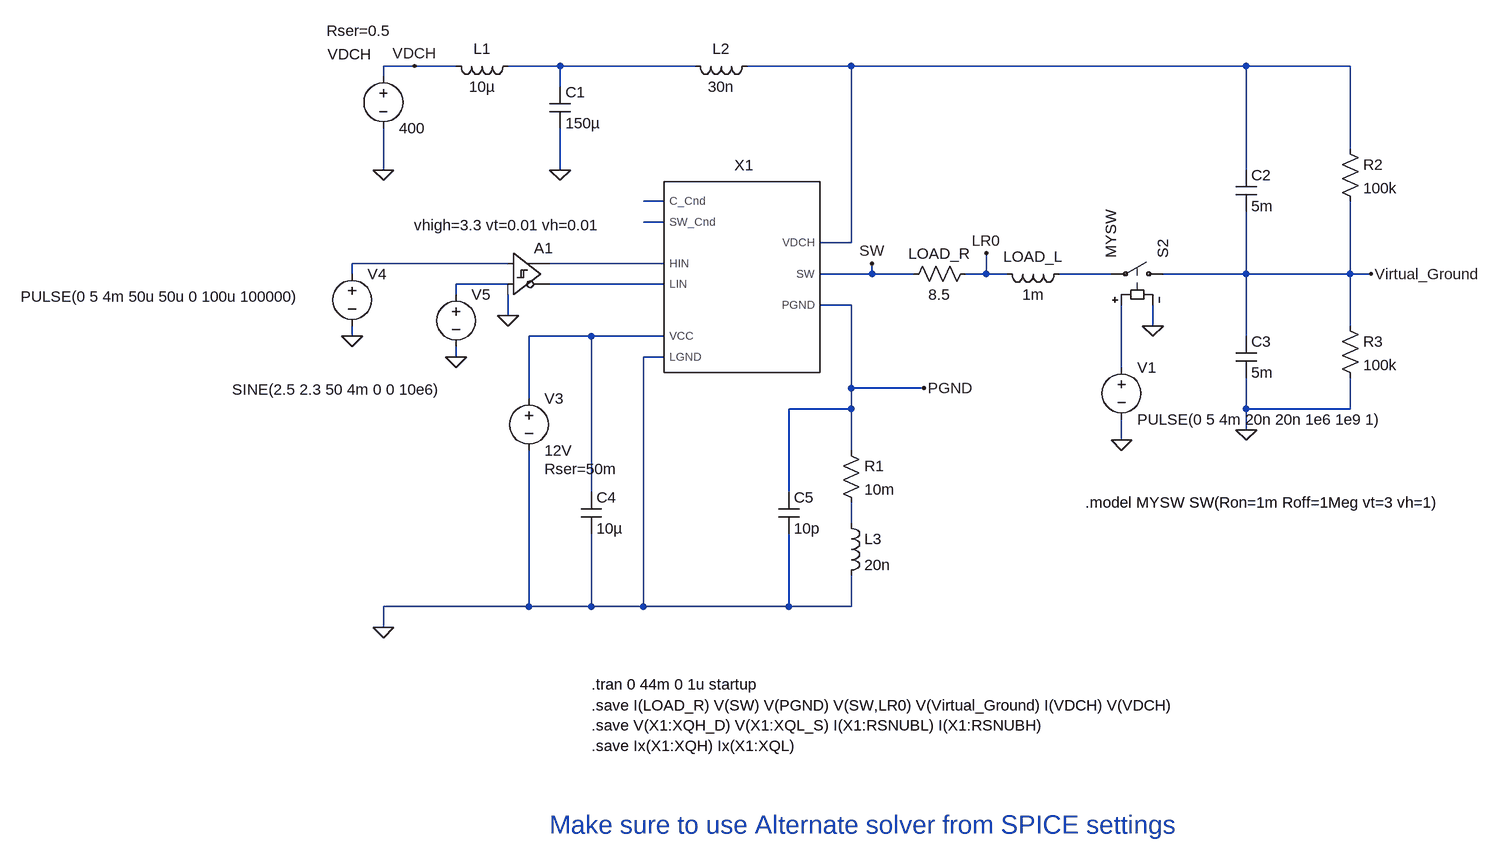
[diagram p0: schematic HBM_SLinverter_test1.asc]
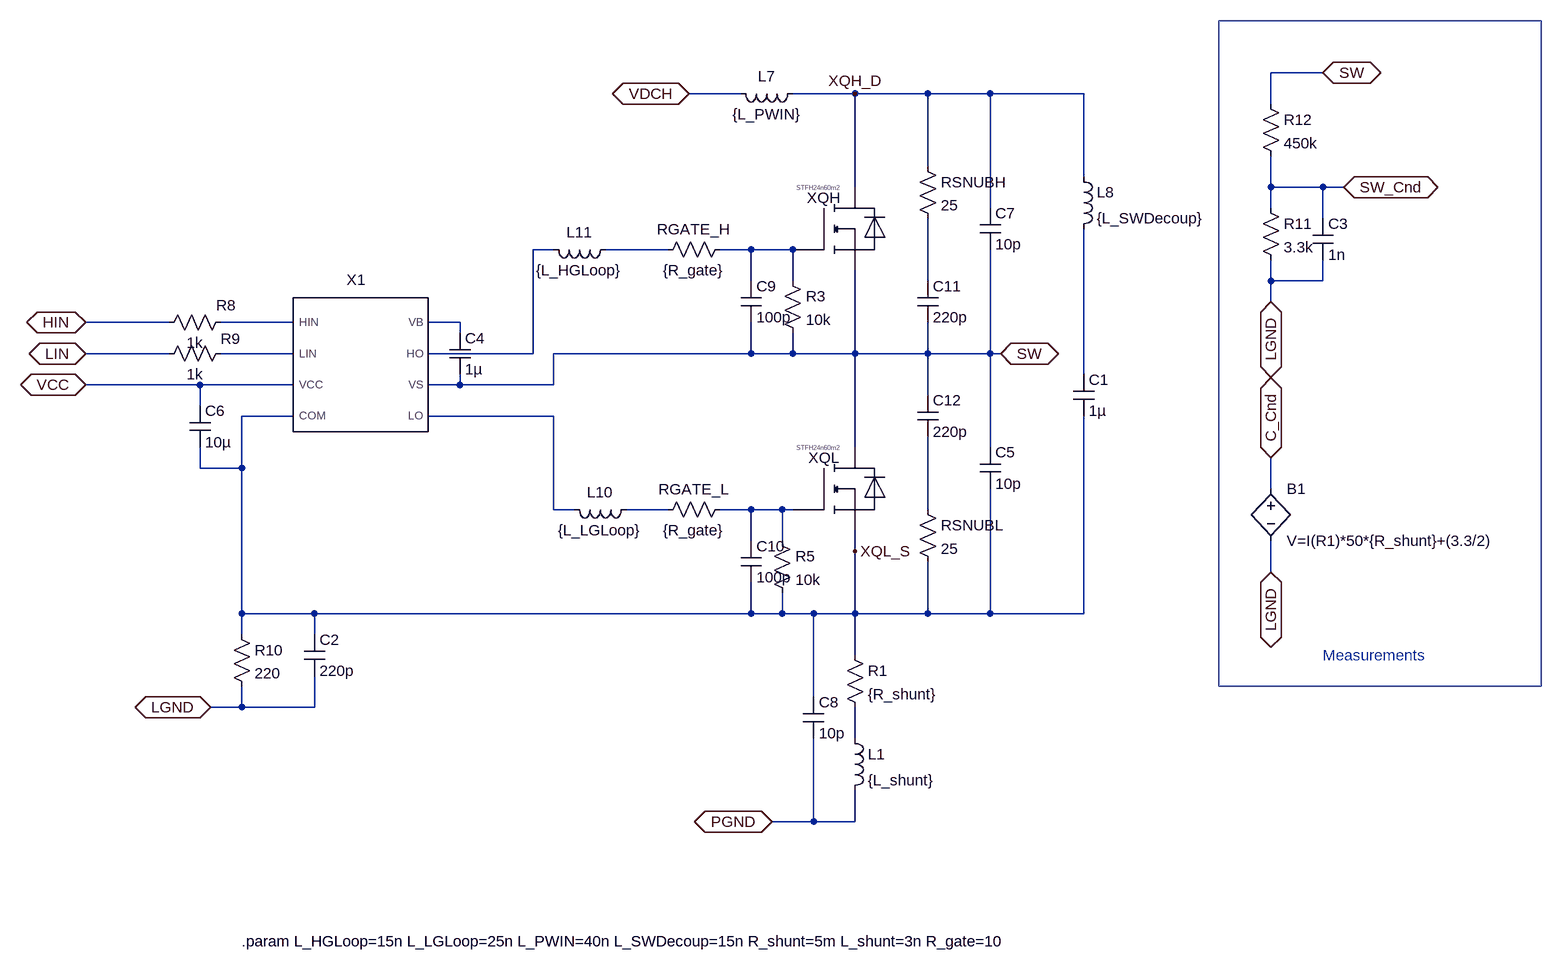
[diagram p1: sub-circuit hbm_g0vh4c5.asc]
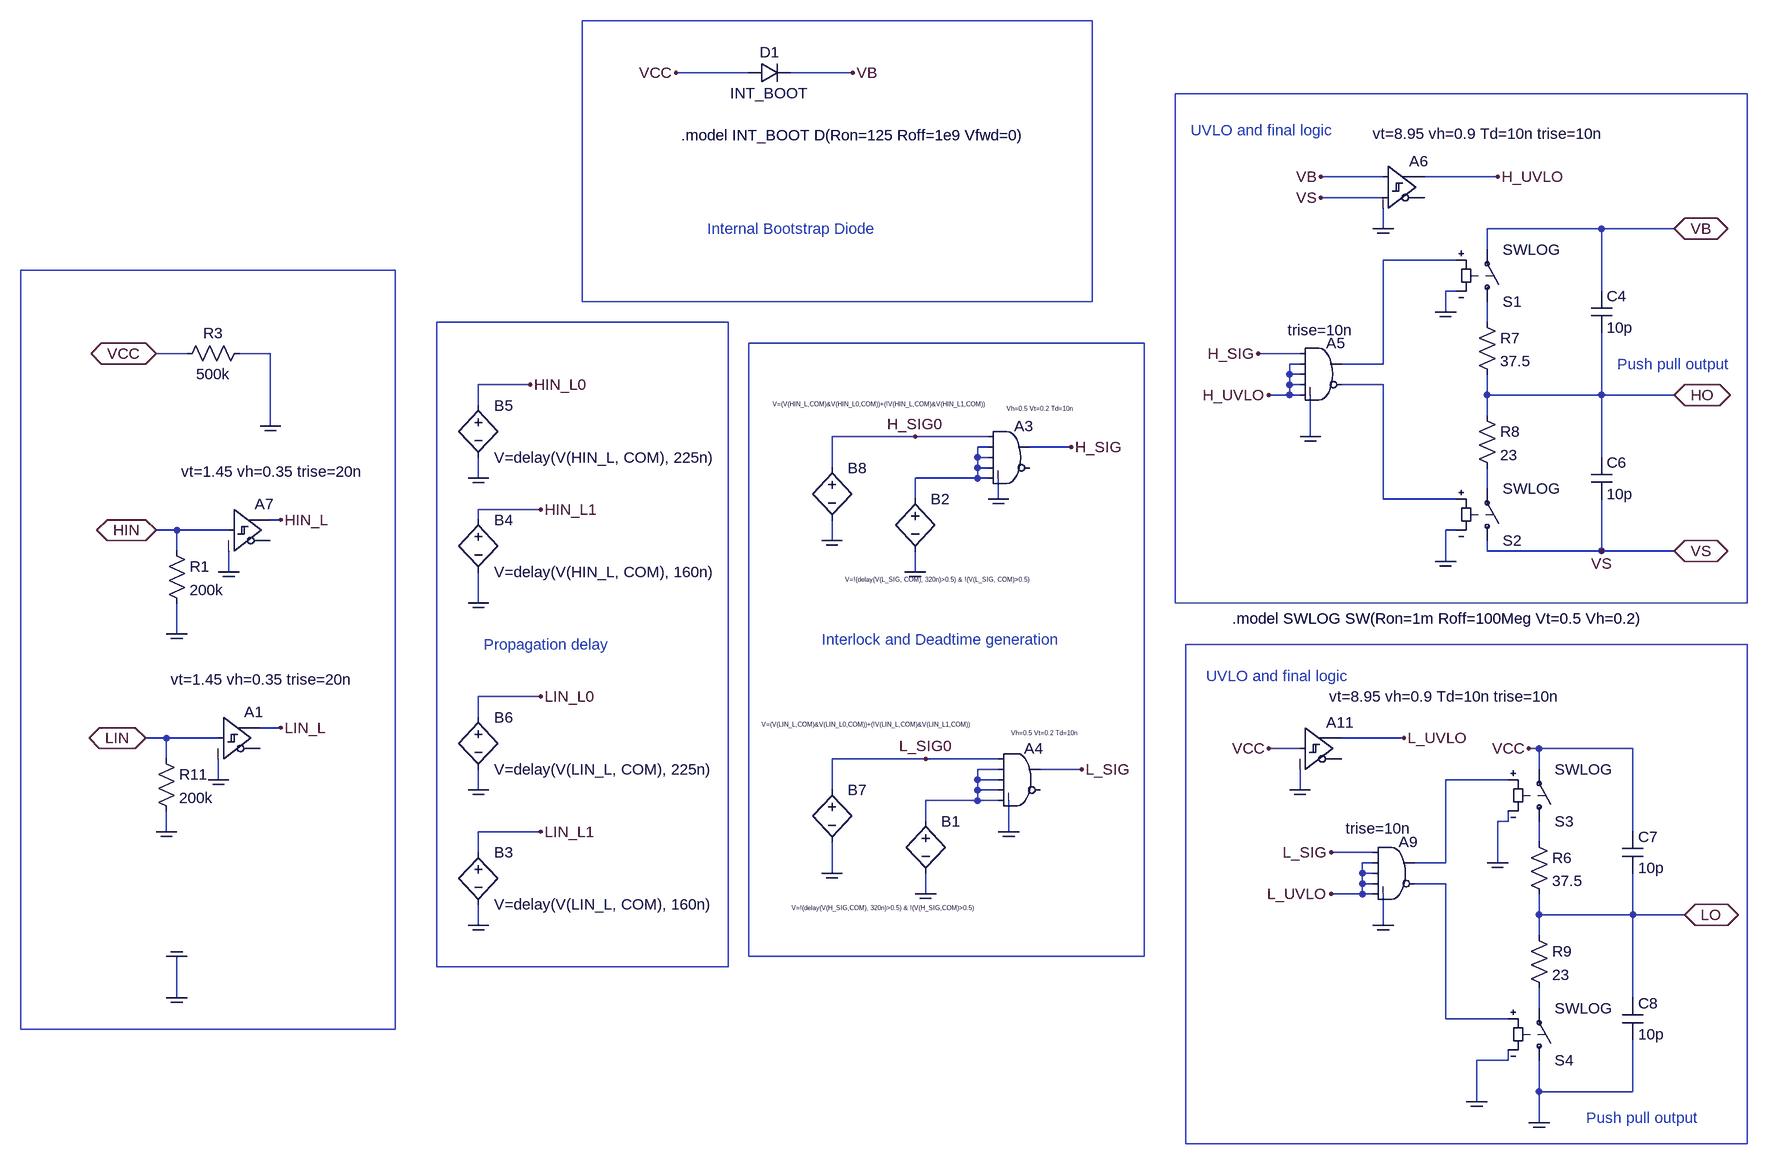
[diagram p2: sub-circuit l6388_behavioral.asc]
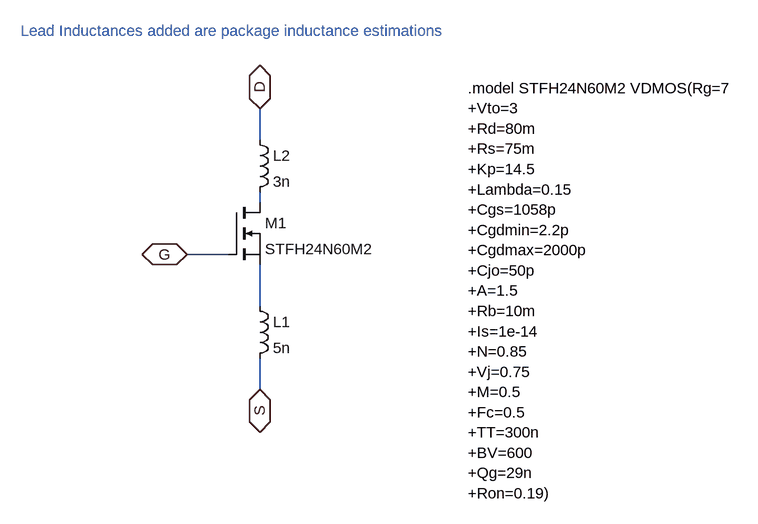
[diagram p3: sub-circuit stfh24n60m2.asc]
HBM_SLinverter_test1.asc, the LTspice schematic file:
Version 4.1
SHEET 1 1396 1020
WIRE -336 -176 -384 -176
WIRE -272 -176 -336 -176
WIRE -112 -176 -192 -176
WIRE 96 -176 -112 -176
WIRE 336 -176 176 -176
WIRE 944 -176 336 -176
WIRE 1104 -176 944 -176
WIRE -384 -160 -384 -176
WIRE -112 -144 -112 -176
WIRE 1104 -48 1104 -176
WIRE -384 -16 -384 -80
WIRE -112 -16 -112 -80
WIRE 944 -16 944 -176
WIRE 48 32 16 32
WIRE 48 64 16 64
WIRE 336 96 336 -176
WIRE 336 96 288 96
WIRE -192 128 -432 128
WIRE 48 128 -128 128
WIRE -432 144 -432 128
WIRE 368 144 368 128
WIRE 368 144 288 144
WIRE 432 144 368 144
WIRE 544 144 544 112
WIRE 544 144 512 144
WIRE 576 144 544 144
WIRE 736 144 656 144
WIRE 944 144 944 48
WIRE 944 144 816 144
WIRE 1104 144 1104 32
WIRE 1104 144 944 144
WIRE 1136 144 1104 144
WIRE -192 160 -272 160
WIRE 48 160 -128 160
WIRE -272 176 -272 160
WIRE 336 192 288 192
WIRE -192 208 -192 176
WIRE 800 224 800 192
WIRE 1104 224 1104 144
WIRE -432 240 -432 224
WIRE -64 240 -160 240
WIRE 48 240 -64 240
WIRE 944 240 944 144
WIRE -272 272 -272 256
WIRE 48 272 16 272
WIRE 752 288 752 192
WIRE 336 320 336 192
WIRE 448 320 336 320
WIRE -160 336 -160 240
WIRE 336 352 336 320
WIRE 336 352 240 352
WIRE 944 352 944 304
WIRE 1104 352 1104 304
WIRE 1104 352 944 352
WIRE 944 384 944 352
WIRE 752 400 752 368
WIRE 336 416 336 352
WIRE -64 480 -64 240
WIRE 240 480 240 352
WIRE 336 528 336 496
WIRE -160 656 -160 416
WIRE -160 656 -384 656
WIRE -64 656 -64 544
WIRE -64 656 -160 656
WIRE 16 656 16 272
WIRE 16 656 -64 656
WIRE 240 656 240 544
WIRE 240 656 16 656
WIRE 336 656 336 608
WIRE 336 656 240 656
WIRE -384 688 -384 656
FLAG -384 -16 0
FLAG 944 384 0
FLAG -384 688 0
FLAG 752 400 0
FLAG 800 224 0
FLAG -112 -16 0
FLAG -192 208 0
FLAG -272 272 0
FLAG -432 240 0
FLAG 1136 144 Virtual_Ground
FLAG 544 112 LR0
FLAG 368 128 SW
FLAG 448 320 PGND
FLAG -336 -176 VDCH
SYMBOL HBM_G0VH4C5 224 144 R0
WINDOW 0 -53 -152 Bottom 2
SYMATTR InstName X1
SYMBOL voltage -384 -176 R0
WINDOW 123 0 0 Left 0
WINDOW 39 -87 -54 Left 2
WINDOW 0 -86 -18 Left 2
SYMATTR SpiceLine Rser=0.5
SYMATTR InstName VDCH
SYMATTR Value 400
SYMBOL cap -128 -144 R0
SYMATTR InstName C1
SYMATTR Value 150µ
SYMBOL ind -176 -192 R90
WINDOW 0 5 56 VBottom 2
WINDOW 3 32 56 VTop 2
SYMATTR InstName L1
SYMATTR Value 10µ
SYMBOL ind 192 -192 R90
WINDOW 0 5 56 VBottom 2
WINDOW 3 32 56 VTop 2
SYMATTR InstName L2
SYMATTR Value 30n
SYMATTR SpiceLine Cpar=10p
SYMBOL res 528 128 R90
WINDOW 0 0 56 VBottom 2
WINDOW 3 32 56 VTop 2
SYMATTR InstName LOAD_R
SYMATTR Value 8.5
SYMBOL ind 672 128 R90
WINDOW 0 5 56 VBottom 2
WINDOW 3 32 56 VTop 2
SYMATTR InstName LOAD_L
SYMATTR Value 1m
SYMBOL cap 928 -16 R0
SYMATTR InstName C2
SYMATTR Value 5m
SYMATTR SpiceLine Rser=50m Lser=10n Cpar=100n
SYMBOL cap 928 240 R0
SYMATTR InstName C3
SYMATTR Value 5m
SYMATTR SpiceLine Rser=50m Lser=10n Cpar=100n
SYMBOL voltage -160 320 R0
WINDOW 123 0 0 Left 0
WINDOW 39 24 124 Left 2
SYMATTR SpiceLine Rser=50m
SYMATTR InstName V3
SYMATTR Value 12V
SYMBOL cap -80 480 R0
SYMATTR InstName C4
SYMATTR Value 10µ
SYMBOL voltage 752 272 R0
WINDOW 123 0 0 Left 0
WINDOW 39 0 0 Left 0
SYMATTR InstName V1
SYMATTR Value PULSE(0 5 4m 20n 20n 1e6 1e9 1)
SYMBOL sw 832 144 M270
SYMATTR InstName S2
SYMATTR Value MYSW
SYMBOL voltage -272 160 R0
WINDOW 123 0 0 Left 0
WINDOW 39 0 0 Left 0
WINDOW 3 -345 162 Left 2
SYMATTR Value SINE(2.5 2.3 50 4m 0 0 10e6)
SYMATTR InstName V5
SYMBOL voltage -432 128 R0
WINDOW 123 0 0 Left 0
WINDOW 39 0 0 Left 0
WINDOW 3 -510 51 Left 2
SYMATTR Value PULSE(0 5 4m 50u 50u 0 100u 100000)
SYMATTR InstName V4
SYMBOL Digital\\diffschmitt -192 80 R0
WINDOW 39 -145 -11 Left 2
SYMATTR SpiceLine vhigh=3.3 vt=0.01 vh=0.01
SYMATTR InstName A1
SYMBOL res 1088 -64 R0
SYMATTR InstName R2
SYMATTR Value 100k
SYMBOL res 1088 208 R0
SYMATTR InstName R3
SYMATTR Value 100k
SYMBOL res 320 400 R0
SYMATTR InstName R1
SYMATTR Value 10m
SYMBOL cap 224 480 R0
SYMATTR InstName C5
SYMATTR Value 10p
SYMBOL ind 320 512 R0
SYMATTR InstName L3
SYMATTR Value 20n
TEXT -64 776 Left 2 !.tran 0 44m 0 1u startup
TEXT 696 496 Left 2 !.model MYSW SW(Ron=1m Roff=1Meg vt=3 vh=1)
TEXT -64 808 Left 2 !.save I(LOAD_R) V(SW) V(PGND) V(SW,LR0) V(Virtual_Ground) I(VDCH) V(VDCH)\n.save V(X1:XQH_D) V(X1:XQL_S) I(X1:RSNUBL) I(X1:RSNUBH)\n.save Ix(X1:XQH) Ix(X1:XQL)
TEXT -128 992 Left 4 ;Make sure to use Alternate solver from SPICE settings

hbm_g0vh4c5.asc, the sub-circuit schematic file:
Version 4.1
SHEET 1 2356 1620
WIRE 1680 -320 1600 -320
WIRE 784 -288 704 -288
WIRE 960 -288 864 -288
WIRE 1072 -288 960 -288
WIRE 1168 -288 1072 -288
WIRE 1312 -288 1168 -288
WIRE 1600 -272 1600 -320
WIRE 1072 -176 1072 -288
WIRE 1312 -160 1312 -288
WIRE 960 -144 960 -288
WIRE 1600 -144 1600 -192
WIRE 1680 -144 1600 -144
WIRE 1712 -144 1680 -144
WIRE 1168 -112 1168 -288
WIRE 1600 -112 1600 -144
WIRE 1680 -96 1680 -144
WIRE 496 -48 464 -48
WIRE 672 -48 576 -48
WIRE 800 -48 752 -48
WIRE 864 -48 800 -48
WIRE 880 -48 864 -48
WIRE 800 0 800 -48
WIRE 864 0 864 -48
WIRE 1072 0 1072 -96
WIRE 1600 0 1600 -32
WIRE 1680 0 1680 -32
WIRE 1680 0 1600 0
WIRE 1600 32 1600 0
WIRE -96 64 -224 64
WIRE 96 64 -16 64
WIRE 352 64 304 64
WIRE 352 80 352 64
WIRE -96 112 -224 112
WIRE 96 112 -16 112
WIRE 464 112 464 -48
WIRE 464 112 304 112
WIRE 800 112 800 64
WIRE 800 112 496 112
WIRE 864 112 864 80
WIRE 864 112 800 112
WIRE 960 112 960 -16
WIRE 960 112 864 112
WIRE 1072 112 1072 64
WIRE 1072 112 960 112
WIRE 1168 112 1168 -48
WIRE 1168 112 1072 112
WIRE 1184 112 1168 112
WIRE 1312 144 1312 -80
WIRE -48 160 -224 160
WIRE 96 160 -48 160
WIRE 352 160 352 144
WIRE 352 160 304 160
WIRE 496 160 496 112
WIRE 496 160 352 160
WIRE 1072 176 1072 112
WIRE -48 192 -48 160
WIRE 96 208 16 208
WIRE 496 208 304 208
WIRE 960 256 960 112
WIRE 1168 256 1168 112
WIRE -48 288 -48 256
WIRE 16 288 16 208
WIRE 16 288 -48 288
WIRE 1600 320 1600 272
WIRE 496 352 496 208
WIRE 528 352 496 352
WIRE 672 352 608 352
WIRE 800 352 752 352
WIRE 848 352 800 352
WIRE 864 352 848 352
WIRE 1072 352 1072 240
WIRE 800 400 800 352
WIRE 848 400 848 352
WIRE 960 416 960 384
WIRE 1600 448 1600 400
WIRE 16 512 16 288
WIRE 128 512 16 512
WIRE 800 512 800 464
WIRE 800 512 128 512
WIRE 848 512 848 480
WIRE 848 512 800 512
WIRE 896 512 848 512
WIRE 960 512 960 416
WIRE 960 512 896 512
WIRE 1072 512 1072 432
WIRE 1072 512 960 512
WIRE 1168 512 1168 320
WIRE 1168 512 1072 512
WIRE 1312 512 1312 208
WIRE 1312 512 1168 512
WIRE 16 544 16 512
WIRE 128 544 128 512
WIRE 960 576 960 512
WIRE 896 640 896 512
WIRE 16 656 16 624
WIRE 16 656 -32 656
WIRE 128 656 128 608
WIRE 128 656 16 656
WIRE 960 704 960 656
WIRE 896 832 896 704
WIRE 896 832 832 832
WIRE 960 832 960 784
WIRE 960 832 896 832
FLAG 832 832 PGND
IOPIN 832 832 BiDir
FLAG 704 -288 VDCH
IOPIN 704 -288 BiDir
FLAG -224 64 HIN
IOPIN -224 64 BiDir
FLAG -224 112 LIN
IOPIN -224 112 BiDir
FLAG -224 160 VCC
IOPIN -224 160 BiDir
FLAG 1184 112 SW
IOPIN 1184 112 BiDir
FLAG 1600 448 LGND
IOPIN 1600 448 BiDir
FLAG 1600 272 C_Cnd
IOPIN 1600 272 BiDir
FLAG -32 656 LGND
IOPIN -32 656 BiDir
FLAG 1680 -320 SW
IOPIN 1680 -320 BiDir
FLAG 1600 32 LGND
IOPIN 1600 32 BiDir
FLAG 1712 -144 SW_Cnd
IOPIN 1712 -144 BiDir
FLAG 960 416 XQL_S
FLAG 960 -288 XQH_D
SYMBOL L6388_Behavioral 256 112 R0
WINDOW 0 -64 -98 Bottom 2
SYMATTR InstName X1
SYMBOL res 944 560 R0
SYMATTR InstName R1
SYMATTR Value {R_shunt}
SYMBOL ind 1296 -176 R0
SYMATTR InstName L8
SYMATTR Value {L_SWDecoup}
SYMBOL cap 1296 144 R0
SYMATTR InstName C1
SYMATTR Value 1µ
SYMBOL ind 592 -64 R90
WINDOW 0 5 56 VBottom 2
WINDOW 3 32 56 VTop 2
SYMATTR InstName L11
SYMATTR Value {L_HGLoop}
SYMBOL res 768 -64 R90
WINDOW 0 0 56 VBottom 2
WINDOW 3 32 56 VTop 2
SYMATTR InstName RGATE_H
SYMATTR Value {R_gate}
SYMBOL res 848 -16 R0
SYMATTR InstName R3
SYMATTR Value 10k
SYMBOL ind 624 336 R90
WINDOW 0 5 56 VBottom 2
WINDOW 3 32 56 VTop 2
SYMATTR InstName L10
SYMATTR Value {L_LGLoop}
SYMBOL res 768 336 R90
WINDOW 0 0 56 VBottom 2
WINDOW 3 32 56 VTop 2
SYMATTR InstName RGATE_L
SYMATTR Value {R_gate}
SYMBOL res 832 384 R0
SYMATTR InstName R5
SYMATTR Value 10k
SYMBOL ind 880 -304 R90
WINDOW 0 5 56 VBottom 2
WINDOW 3 32 56 VTop 2
SYMATTR InstName L7
SYMATTR Value {L_PWIN}
SYMBOL cap 336 80 R0
SYMATTR InstName C4
SYMATTR Value 1µ
SYMBOL bv 1600 304 R0
SYMATTR InstName B1
SYMATTR Value V=I(R1)*50*{R_shunt}+(3.3/2)
SYMBOL cap -64 192 R0
SYMATTR InstName C6
SYMATTR Value 10µ
SYMBOL res 0 48 R90
WINDOW 0 5 8 VBottom 2
WINDOW 3 32 56 VTop 2
SYMATTR InstName R8
SYMATTR Value 1k
SYMBOL res 0 96 R90
WINDOW 0 9 1 VBottom 2
WINDOW 3 32 56 VTop 2
SYMATTR InstName R9
SYMATTR Value 1k
SYMBOL res 0 528 R0
SYMATTR InstName R10
SYMATTR Value 220
SYMBOL cap 112 544 R0
SYMATTR InstName C2
SYMATTR Value 220p
SYMATTR SpiceLine Rser=20m
SYMBOL res 1584 -128 R0
SYMATTR InstName R11
SYMATTR Value 3.3k
SYMBOL res 1584 -288 R0
SYMATTR InstName R12
SYMATTR Value 450k
SYMBOL cap 1664 -96 R0
SYMATTR InstName C3
SYMATTR Value 1n
SYMBOL STFH24N60M2 1040 -80 R0
SYMATTR InstName XQH
SYMBOL STFH24N60M2 1040 320 R0
SYMATTR InstName XQL
SYMBOL cap 784 0 R0
SYMATTR InstName C9
SYMATTR Value 100p
SYMBOL cap 784 400 R0
SYMATTR InstName C10
SYMATTR Value 100p
SYMBOL cap 1152 256 R0
SYMATTR InstName C5
SYMATTR Value 10p
SYMBOL cap 1152 -112 R0
SYMATTR InstName C7
SYMATTR Value 10p
SYMBOL cap 880 640 R0
SYMATTR InstName C8
SYMATTR Value 10p
SYMBOL ind 944 688 R0
SYMATTR InstName L1
SYMATTR Value {L_shunt}
SYMBOL cap 1056 0 R0
SYMATTR InstName C11
SYMATTR Value 220p
SYMBOL cap 1056 176 R0
SYMATTR InstName C12
SYMATTR Value 220p
SYMBOL res 1056 -192 R0
SYMATTR InstName RSNUBH
SYMATTR Value 25
SYMBOL res 1056 336 R0
SYMATTR InstName RSNUBL
SYMATTR Value 25
TEXT 1680 576 Left 2 ;Measurements
TEXT 16 1016 Left 2 !.param L_HGLoop=15n L_LGLoop=25n L_PWIN=40n L_SWDecoup=15n R_shunt=5m L_shunt=3n R_gate=10
RECTANGLE Normal 2016 624 1520 -400

l6388_behavioral.asc, the sub-circuit schematic file:
Version 4.1
SHEET 1 2452 1396
WIRE 720 -560 608 -560
WIRE 880 -560 784 -560
WIRE 1696 -400 1600 -400
WIRE 1872 -400 1760 -400
WIRE 1696 -368 1600 -368
WIRE 1696 -320 1696 -352
WIRE 2032 -320 1856 -320
WIRE 2144 -320 2032 -320
WIRE 1856 -288 1856 -320
WIRE 1808 -272 1696 -272
WIRE 1808 -224 1792 -224
WIRE 2032 -224 2032 -320
WIRE 1792 -192 1792 -224
WIRE 1856 -176 1856 -208
WIRE -144 -128 -192 -128
WIRE -16 -128 -64 -128
WIRE 1568 -128 1504 -128
WIRE 1568 -112 1552 -112
WIRE 1696 -112 1696 -272
WIRE 1696 -112 1632 -112
WIRE 1552 -96 1552 -112
WIRE 1568 -96 1552 -96
WIRE 384 -80 304 -80
WIRE 1552 -80 1552 -96
WIRE 1568 -80 1552 -80
WIRE 1696 -80 1632 -80
WIRE 1552 -64 1552 -80
WIRE 1552 -64 1520 -64
WIRE 1568 -64 1552 -64
WIRE 1856 -64 1856 -96
WIRE 2032 -64 2032 -160
WIRE 2032 -64 1856 -64
WIRE 2144 -64 2032 -64
WIRE 304 -48 304 -80
WIRE 1856 -32 1856 -64
WIRE -16 -16 -16 -128
WIRE 976 0 848 0
WIRE 1088 0 976 0
WIRE 1584 0 1584 -64
WIRE 1088 16 1072 16
WIRE 1216 16 1152 16
WIRE 1072 32 1072 16
WIRE 1088 32 1072 32
WIRE 2032 32 2032 -64
WIRE 848 48 848 0
WIRE 1072 48 1072 32
WIRE 1088 48 1072 48
WIRE 304 64 304 32
WIRE 1072 64 1072 48
WIRE 1072 64 976 64
WIRE 1088 64 1072 64
WIRE 1856 80 1856 48
WIRE 976 96 976 64
WIRE 1104 96 1104 64
WIRE 1696 96 1696 -80
WIRE 1808 96 1696 96
WIRE 400 112 304 112
WIRE 0 128 -16 128
WIRE 304 128 304 112
WIRE -160 144 -192 144
WIRE -80 144 -160 144
WIRE 1808 144 1792 144
WIRE 848 160 848 128
WIRE -160 176 -160 144
WIRE 1856 176 1856 160
WIRE 2032 176 2032 96
WIRE 2032 176 1856 176
WIRE 2144 176 2032 176
WIRE 1792 192 1792 144
WIRE -80 208 -80 176
WIRE 976 208 976 176
WIRE 304 256 304 208
WIRE -160 304 -160 256
WIRE 400 400 304 400
WIRE 304 432 304 400
WIRE 0 448 -32 448
WIRE -176 464 -208 464
WIRE -96 464 -176 464
WIRE 1728 464 1632 464
WIRE 1568 480 1520 480
WIRE 1936 480 1920 480
WIRE 2080 480 1936 480
WIRE -176 496 -176 464
WIRE 992 496 848 496
WIRE 1104 496 992 496
WIRE 1104 512 1072 512
WIRE 1232 512 1168 512
WIRE 1936 512 1936 480
WIRE -96 528 -96 496
WIRE 1072 528 1072 512
WIRE 1104 528 1072 528
WIRE 1888 528 1792 528
WIRE 304 544 304 512
WIRE 848 544 848 496
WIRE 1072 544 1072 528
WIRE 1104 544 1072 544
WIRE 1568 544 1568 512
WIRE 1072 560 1072 544
WIRE 1072 560 992 560
WIRE 1104 560 1072 560
WIRE 992 592 992 560
WIRE 1888 592 1888 576
WIRE 1888 592 1872 592
WIRE -176 608 -176 576
WIRE 400 608 304 608
WIRE 1120 608 1120 560
WIRE 2080 608 2080 480
WIRE 1936 624 1936 592
WIRE 304 640 304 608
WIRE 1680 640 1616 640
WIRE 1680 656 1664 656
WIRE 1792 656 1792 528
WIRE 1792 656 1744 656
WIRE 1872 656 1872 592
WIRE 848 672 848 624
WIRE 1664 672 1664 656
WIRE 1680 672 1664 672
WIRE 1664 688 1664 672
WIRE 1680 688 1664 688
WIRE 1792 688 1744 688
WIRE 992 704 992 672
WIRE 1664 704 1664 688
WIRE 1664 704 1616 704
WIRE 1680 704 1664 704
WIRE 1936 736 1936 704
WIRE 2080 736 2080 672
WIRE 2080 736 1936 736
WIRE 2160 736 2080 736
WIRE 304 752 304 720
WIRE 1696 752 1696 704
WIRE 1936 768 1936 736
WIRE -160 864 -160 800
WIRE 2080 864 2080 736
WIRE 1936 880 1936 848
WIRE 1792 896 1792 688
WIRE 1888 896 1792 896
WIRE 1888 960 1888 944
WIRE 1888 960 1840 960
WIRE 1936 1008 1936 960
WIRE 2080 1008 2080 928
WIRE 2080 1008 1936 1008
WIRE 1840 1024 1840 960
WIRE 1936 1056 1936 1008
FLAG -192 144 HIN
IOPIN -192 144 BiDir
FLAG -208 464 LIN
IOPIN -208 464 BiDir
FLAG -160 800 COM
IOPIN -160 800 BiDir
FLAG -192 -128 VCC
IOPIN -192 -128 BiDir
FLAG 2144 -64 HO
IOPIN 2144 -64 BiDir
FLAG 2144 176 VS
IOPIN 2144 176 BiDir
FLAG 2144 -320 VB
IOPIN 2144 -320 BiDir
FLAG -160 864 COM
FLAG -160 304 COM
FLAG 1232 512 L_SIG
FLAG 1216 16 H_SIG
FLAG 2160 736 LO
IOPIN 2160 736 BiDir
FLAG 1936 1056 COM
FLAG 1920 480 VCC
FLAG 1600 -400 VB
FLAG 1696 -320 COM
FLAG 1568 544 COM
FLAG 1520 480 VCC
FLAG 1728 464 L_UVLO
FLAG 1872 -400 H_UVLO
FLAG 1504 -128 H_SIG
FLAG 1520 -64 H_UVLO
FLAG 1616 704 L_UVLO
FLAG 1616 640 L_SIG
FLAG 1120 608 COM
FLAG 1696 752 COM
FLAG 1584 0 COM
FLAG 1104 96 COM
FLAG -16 -16 COM
FLAG 1840 1024 COM
FLAG 1872 656 COM
FLAG 992 704 COM
FLAG 976 208 COM
FLAG 304 752 COM
FLAG 304 256 COM
FLAG 1792 -192 COM
FLAG 1792 192 COM
FLAG 1600 -368 VS
FLAG 2032 176 VS
FLAG -80 208 COM
FLAG -96 528 COM
FLAG 0 128 HIN_L
FLAG 304 64 COM
FLAG 304 544 COM
FLAG 384 -80 HIN_L0
FLAG 400 112 HIN_L1
FLAG 400 400 LIN_L0
FLAG 400 608 LIN_L1
FLAG 848 672 COM
FLAG 848 160 COM
FLAG 976 0 H_SIG0
FLAG 992 496 L_SIG0
FLAG 0 448 LIN_L
FLAG -176 608 COM
FLAG 608 -560 VCC
FLAG 880 -560 VB
SYMBOL res -176 160 R0
SYMATTR InstName R1
SYMATTR Value 200k
SYMBOL res -48 -144 R90
WINDOW 0 0 56 VBottom 2
WINDOW 3 32 56 VTop 2
SYMATTR InstName R3
SYMATTR Value 500k
SYMBOL Digital\\and 1120 -32 R0
WINDOW 39 -3 -11 Left 0
SYMATTR SpiceLine Vh=0.5 Vt=0.2 Td=10n
SYMATTR InstName A3
SYMBOL Digital\\and 1136 464 R0
WINDOW 39 -12 -8 Left 0
SYMATTR SpiceLine Vh=0.5 Vt=0.2 Td=10n
SYMATTR InstName A4
SYMBOL sw 1856 -192 M180
SYMATTR InstName S1
SYMATTR Value SWLOG
SYMBOL sw 1856 176 M180
SYMATTR InstName S2
SYMATTR Value SWLOG
SYMBOL res 1840 -192 R0
SYMATTR InstName R7
SYMATTR Value 37.5
SYMBOL res 1840 -48 R0
SYMATTR InstName R8
SYMATTR Value 23
SYMBOL sw 1936 608 M180
SYMATTR InstName S3
SYMATTR Value SWLOG
SYMBOL sw 1936 976 M180
SYMATTR InstName S4
SYMATTR Value SWLOG
SYMBOL res 1920 608 R0
SYMATTR InstName R6
SYMATTR Value 37.5
SYMBOL res 1920 752 R0
SYMATTR InstName R9
SYMATTR Value 23
SYMBOL Digital\\and 1600 -160 R0
WINDOW 39 -51 -4 Left 2
SYMATTR SpiceLine trise=10n
SYMATTR InstName A5
SYMBOL Digital\\and 1712 608 R0
WINDOW 39 -74 -5 Left 2
SYMATTR SpiceLine trise=10n
SYMATTR InstName A9
SYMBOL bv 992 576 R0
WINDOW 3 -206 149 Left 0
SYMATTR Value V=!(delay(V(H_SIG,COM), 320n)>0.5) & !(V(H_SIG,COM)>0.5)
SYMATTR InstName B1
SYMBOL bv 976 80 R0
WINDOW 3 -108 140 Left 0
SYMATTR Value V=!(delay(V(L_SIG, COM), 320n)>0.5) & !(V(L_SIG, COM)>0.5)
SYMATTR InstName B2
SYMBOL bv 304 624 R0
SYMATTR InstName B3
SYMATTR Value V=delay(V(LIN_L, COM), 160n)
SYMBOL bv 304 112 R0
SYMATTR InstName B4
SYMATTR Value V=delay(V(HIN_L, COM), 160n)
SYMBOL Digital\\schmitt 1568 416 R0
WINDOW 39 45 -16 Left 2
SYMATTR SpiceLine vt=8.95 vh=0.9 Td=10n trise=10n
SYMATTR InstName A11
SYMBOL Digital\\diffschmitt 1696 -448 R0
WINDOW 39 -16 -18 Left 2
SYMATTR SpiceLine vt=8.95 vh=0.9 Td=10n trise=10n
SYMATTR InstName A6
SYMBOL Digital\\schmitt -80 80 R0
WINDOW 39 -73 -26 Left 2
SYMATTR SpiceLine vt=1.45 vh=0.35 trise=20n
SYMATTR InstName A7
SYMBOL Digital\\schmitt -96 400 R0
WINDOW 39 -73 -26 Left 2
SYMATTR SpiceLine vt=1.45 vh=0.35 trise=20n
SYMATTR InstName A1
SYMBOL bv 304 -64 R0
SYMATTR InstName B5
SYMATTR Value V=delay(V(HIN_L, COM), 225n)
SYMBOL bv 304 416 R0
SYMATTR InstName B6
SYMATTR Value V=delay(V(LIN_L, COM), 225n)
SYMBOL bv 848 528 R0
WINDOW 3 -108 -85 Left 0
SYMATTR Value V=(V(LIN_L,COM)&V(LIN_L0,COM))+(!V(LIN_L,COM)&V(LIN_L1,COM))
SYMATTR InstName B7
SYMBOL bv 848 32 R0
WINDOW 3 -91 -82 Left 0
SYMATTR Value V=(V(HIN_L,COM)&V(HIN_L0,COM))+(!V(HIN_L,COM)&V(HIN_L1,COM))
SYMATTR InstName B8
SYMBOL res -192 480 R0
SYMATTR InstName R11
SYMATTR Value 200k
SYMBOL cap 2016 -224 R0
SYMATTR InstName C4
SYMATTR Value 10p
SYMBOL cap 2016 32 R0
SYMATTR InstName C6
SYMATTR Value 10p
SYMBOL cap 2064 608 R0
SYMATTR InstName C7
SYMATTR Value 10p
SYMBOL cap 2064 864 R0
SYMATTR InstName C8
SYMATTR Value 10p
SYMBOL diode 720 -544 R270
WINDOW 0 32 32 VTop 2
WINDOW 3 0 32 VBottom 2
SYMATTR InstName D1
SYMATTR Value INT_BOOT
TEXT 1464 280 Left 2 !.model SWLOG SW(Ron=1m Roff=100Meg Vt=0.5 Vh=0.2)
TEXT 312 320 Left 2 ;Propagation delay
TEXT 832 312 Left 2 ;Interlock and Deadtime generation
TEXT 1400 -472 Left 2 ;UVLO and final logic
TEXT 1424 368 Left 2 ;UVLO and final logic
TEXT 2008 1048 Left 2 ;Push pull output
TEXT 2056 -112 Left 2 ;Push pull output
TEXT 616 -464 Left 2 !.model INT_BOOT D(Ron=125 Roff=1e9 Vfwd=0)
TEXT 656 -320 Left 2 ;Internal Bootstrap Diode
RECTANGLE Normal 688 816 240 -176
RECTANGLE Normal 1328 800 720 -144
RECTANGLE Normal 2256 1088 1392 320
RECTANGLE Normal 2256 256 1376 -528
RECTANGLE Normal 176 912 -400 -256
RECTANGLE Normal 1248 -208 464 -640

stfh24n60m2.asc, the sub-circuit schematic file:
Version 4.1
SHEET 1 2968 980
WIRE -256 -144 -256 -192
WIRE -256 -48 -256 -64
WIRE -304 32 -368 32
WIRE -256 112 -256 48
WIRE -256 240 -256 192
FLAG -256 -192 D
IOPIN -256 -192 BiDir
FLAG -368 32 G
IOPIN -368 32 BiDir
FLAG -256 240 S
IOPIN -256 240 BiDir
SYMBOL nmos -304 -48 R0
SYMATTR InstName M1
SYMATTR Value STFH24N60M2
SYMBOL ind -272 96 R0
SYMATTR InstName L1
SYMATTR Value 5n
SYMATTR SpiceLine Cpar=10p
SYMBOL ind -272 -160 R0
SYMATTR InstName L2
SYMATTR Value 3n
SYMATTR SpiceLine Cpar=10p
TEXT -624 -312 Left 2 ;Lead Inductances added are package inductance estimations
TEXT 64 -224 Left 2 !.model STFH24N60M2 VDMOS(Rg=7 \n+Vto=3\n+Rd=80m\n+Rs=75m\n+Kp=14.5\n+Lambda=0.15\n+Cgs=1058p\n+Cgdmin=2.2p\n+Cgdmax=2000p\n+Cjo=50p\n+A=1.5\n+Rb=10m\n+Is=1e-14\n+N=0.85\n+Vj=0.75\n+M=0.5\n+Fc=0.5\n+TT=300n\n+BV=600\n+Qg=29n\n+Ron=0.19)

The netlist it stands for:
* HBM_SLinverter_test1.asc
X§X1 N003 N006 0 N009 PGND SW N004 N010 N002 hbm_g0vh4c5
VDCH VDCH 0 400 Rser=0.5
C1 N001 0 150µ
L1 N001 VDCH 10µ
L2 N002 N001 30n Cpar=10p
R§LOAD_R LR0 SW 8.5
LOAD_L N007 LR0 1m
C2 N002 Virtual_Ground 5m Rser=50m Lser=10n Cpar=100n
C3 Virtual_Ground 0 5m Rser=50m Lser=10n Cpar=100n
V3 N010 0 12V Rser=50m
C4 N010 0 10µ
V1 N011 0 PULSE(0 5 4m 20n 20n 1e6 1e9 1)
S2 Virtual_Ground N007 N011 0 MYSW
V5 N008 0 SINE(2.5 2.3 50 4m 0 0 10e6)
V4 N005 0 PULSE(0 5 4m 50u 50u 0 100u 100000)
A1 N005 N008 0 0 0 N009 N006 0 SCHMITT vhigh=3.3 vt=0.01 vh=0.01
R2 N002 Virtual_Ground 100k
R3 Virtual_Ground 0 100k
R1 PGND N012 10m
C5 PGND 0 10p
L3 N012 0 20n

* block symbol definitions
.subckt hbm_g0vh4c5 C_Cnd HIN LGND LIN PGND SW SW_Cnd VCC VDCH
X§X1 XQL_S N005 N001 N009 N006 VCC SW N007 l6388_behavioral
R1 XQL_S N013 {R_shunt}
L8 XQH_D N008 {L_SWDecoup}
C1 N008 XQL_S 1µ
L11 N002 N001 {L_HGLoop}
RGATE_H N003 N002 {R_gate}
R3 N003 SW 10k
L10 N010 N009 {L_LGLoop}
RGATE_L N011 N010 {R_gate}
R5 N011 XQL_S 10k
L7 XQH_D VDCH {L_PWIN}
C4 N006 SW 1µ
B1 C_Cnd LGND V=I(R1)*50*{R_shunt}+(3.3/2)
C6 VCC XQL_S 10µ
R8 N005 HIN 1k
R9 N007 LIN 1k
R10 XQL_S LGND 220
C2 XQL_S LGND 220p Rser=20m
R11 SW_Cnd LGND 3.3k
R12 SW SW_Cnd 450k
C3 SW_Cnd LGND 1n
X§XQH XQH_D N003 SW stfh24n60m2
X§XQL SW N011 XQL_S stfh24n60m2
C9 N003 SW 100p
C10 N011 XQL_S 100p
C5 SW XQL_S 10p
C7 XQH_D SW 10p
C8 XQL_S PGND 10p
L1 N013 PGND {L_shunt}
C11 N004 SW 220p
C12 SW N012 220p
RSNUBH XQH_D N004 25
RSNUBL N012 XQL_S 25
* Measurements
.param L_HGLoop=15n L_LGLoop=25n L_PWIN=40n L_SWDecoup=15n R_shunt=5m L_shunt=3n R_gate=10
.ends hbm_g0vh4c5

.subckt l6388_behavioral COM HIN HO LO VB VCC VS LIN
R1 HIN COM 200k
R3 COM VCC 500k
A3 H_SIG0 N004 N004 N004 N004 COM H_SIG COM AND Vh=0.5 Vt=0.2 Td=10n
A4 L_SIG0 N006 N006 N006 N006 COM L_SIG COM AND Vh=0.5 Vt=0.2 Td=10n
S1 N002 VB N001 COM SWLOG
S2 VS N005 N003 COM SWLOG
R7 N002 HO 37.5
R8 HO N005 23
S3 N008 VCC N007 COM SWLOG
S4 COM N010 N009 COM SWLOG
R6 N008 LO 37.5
R9 LO N010 23
A5 H_SIG H_UVLO H_UVLO H_UVLO H_UVLO N003 N001 COM AND trise=10n
A9 L_SIG L_UVLO L_UVLO L_UVLO L_UVLO N009 N007 COM AND trise=10n
B1 N006 COM V=!(delay(V(H_SIG,COM), 320n)>0.5) & !(V(H_SIG,COM)>0.5)
B2 N004 COM V=!(delay(V(L_SIG, COM), 320n)>0.5) & !(V(L_SIG, COM)>0.5)
B3 LIN_L1 COM V=delay(V(LIN_L, COM), 160n)
B4 HIN_L1 COM V=delay(V(HIN_L, COM), 160n)
A11 VCC COM COM COM COM COM L_UVLO COM SCHMITT vt=8.95 vh=0.9 Td=10n trise=10n
A6 VB VS COM COM COM COM H_UVLO COM SCHMITT vt=8.95 vh=0.9 Td=10n trise=10n
A7 HIN COM COM COM COM COM HIN_L COM SCHMITT vt=1.45 vh=0.35 trise=20n
A1 LIN COM COM COM COM COM LIN_L COM SCHMITT vt=1.45 vh=0.35 trise=20n
B5 HIN_L0 COM V=delay(V(HIN_L, COM), 225n)
B6 LIN_L0 COM V=delay(V(LIN_L, COM), 225n)
B7 L_SIG0 COM V=(V(LIN_L,COM)&V(LIN_L0,COM))+(!V(LIN_L,COM)&V(LIN_L1,COM))
B8 H_SIG0 COM V=(V(HIN_L,COM)&V(HIN_L0,COM))+(!V(HIN_L,COM)&V(HIN_L1,COM))
R11 LIN COM 200k
C4 VB HO 10p
C6 HO VS 10p
C7 VCC LO 10p
C8 LO COM 10p
D1 VCC VB INT_BOOT
.model SWLOG SW(Ron=1m Roff=100Meg Vt=0.5 Vh=0.2)
* Propagation delay
* Interlock and Deadtime generation
* UVLO and final logic
* UVLO and final logic
* Push pull output
* Push pull output
.model INT_BOOT D(Ron=125 Roff=1e9 Vfwd=0)
* Internal Bootstrap Diode
.ends l6388_behavioral

.subckt stfh24n60m2 D G S
M1 N001 G N002 N002 STFH24N60M2
L1 N002 S 5n Cpar=10p
L2 D N001 3n Cpar=10p
* Lead Inductances added are package inductance estimations
.model STFH24N60M2 VDMOS(Rg=7
+Vto=3
+Rd=80m
+Rs=75m
+Kp=14.5
+Lambda=0.15
+Cgs=1058p
+Cgdmin=2.2p
+Cgdmax=2000p
+Cjo=50p
+A=1.5
+Rb=10m
+Is=1e-14
+N=0.85
+Vj=0.75
+M=0.5
+Fc=0.5
+TT=300n
+BV=600
+Qg=29n
+Ron=0.19)
.ends stfh24n60m2

.model D D
.lib standard.dio
.model NMOS NMOS
.model PMOS PMOS
.lib standard.mos
.tran 0 44m 0 1u startup
.model MYSW SW(Ron=1m Roff=1Meg vt=3 vh=1)
.save I(LOAD_R) V(SW) V(PGND) V(SW,LR0) V(Virtual_Ground) I(VDCH) V(VDCH)
.save V(X1:XQH_D) V(X1:XQL_S) I(X1:RSNUBL) I(X1:RSNUBH)
.save Ix(X1:XQH) Ix(X1:XQL)
* Make sure to use Alternate solver from SPICE settings
.backanno
.end